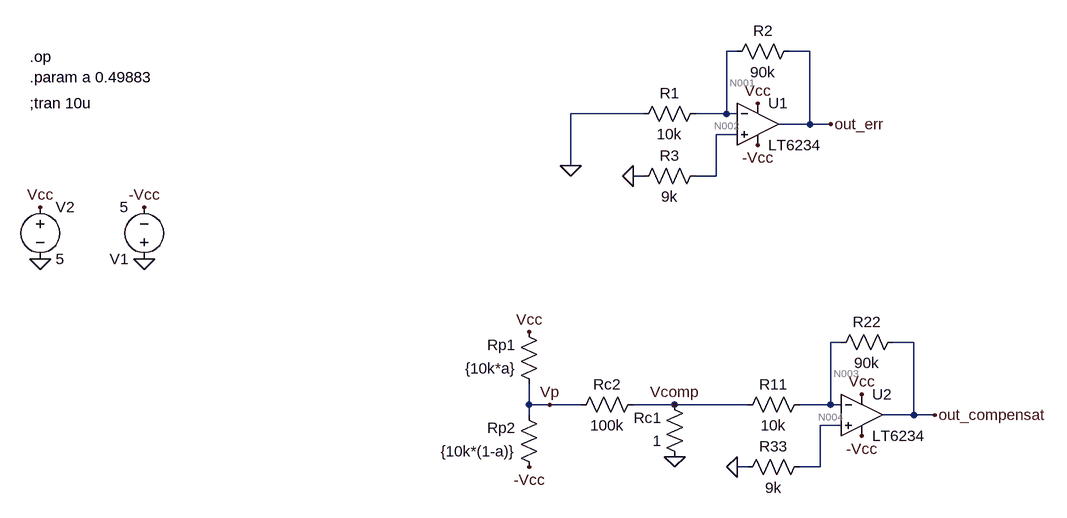
[diagram p0: schematic CompensareDC.asc]
CompensareDC.asc, the LTspice schematic file:
Version 4
SHEET 1 1796 800
WIRE 208 -320 192 -320
WIRE 320 -320 288 -320
WIRE 64 -224 -48 -224
WIRE 192 -224 192 -320
WIRE 192 -224 144 -224
WIRE 208 -224 192 -224
WIRE 320 -208 320 -320
WIRE 320 -208 272 -208
WIRE 352 -208 320 -208
WIRE 208 -192 176 -192
WIRE -48 -144 -48 -224
WIRE 64 -128 48 -128
WIRE 176 -128 176 -192
WIRE 176 -128 144 -128
WIRE 368 128 352 128
WIRE 480 128 448 128
WIRE -112 224 -112 192
WIRE -80 224 -112 224
WIRE -32 224 -80 224
WIRE 112 224 48 224
WIRE 224 224 112 224
WIRE 352 224 352 128
WIRE 352 224 304 224
WIRE 368 224 352 224
WIRE -112 240 -112 224
WIRE 480 240 480 128
WIRE 480 240 432 240
WIRE 512 240 480 240
WIRE 368 256 336 256
WIRE 224 320 208 320
WIRE 336 320 336 256
WIRE 336 320 304 320
FLAG -864 0 0
FLAG -704 0 0
FLAG -864 -80 Vcc
FLAG -704 -80 -Vcc
FLAG 240 -240 Vcc
FLAG 240 -176 -Vcc
FLAG 48 -128 0
FLAG 352 -208 out_err
FLAG 400 208 Vcc
FLAG 400 272 -Vcc
FLAG 208 320 0
FLAG 512 240 out_compensat
FLAG 112 304 0
FLAG -112 112 Vcc
FLAG -112 320 -Vcc
FLAG -48 -144 0
FLAG -80 224 Vp
FLAG 112 224 Vcomp
SYMBOL OpAmps\\LT6234 240 -208 R0
SYMATTR InstName U1
SYMBOL voltage -864 -96 R0
WINDOW 123 0 0 Left 0
WINDOW 39 0 0 Left 0
SYMATTR InstName V2
SYMATTR Value 5
SYMBOL voltage -704 16 R180
WINDOW 123 0 0 Left 0
WINDOW 39 0 0 Left 0
SYMATTR InstName V1
SYMATTR Value 5
SYMBOL res 160 -240 R90
WINDOW 0 0 56 VBottom 2
WINDOW 3 32 56 VTop 2
SYMATTR InstName R1
SYMATTR Value 10k
SYMBOL res 304 -336 R90
WINDOW 0 0 56 VBottom 2
WINDOW 3 32 56 VTop 2
SYMATTR InstName R2
SYMATTR Value 90k
SYMBOL res 160 -144 R90
WINDOW 0 0 56 VBottom 2
WINDOW 3 32 56 VTop 2
SYMATTR InstName R3
SYMATTR Value 9k
SYMBOL OpAmps\\LT6234 400 240 R0
SYMATTR InstName U2
SYMBOL res 320 208 R90
WINDOW 0 0 56 VBottom 2
WINDOW 3 32 56 VTop 2
SYMATTR InstName R11
SYMATTR Value 10k
SYMBOL res 464 112 R90
WINDOW 0 0 56 VBottom 2
WINDOW 3 32 56 VTop 2
SYMATTR InstName R22
SYMATTR Value 90k
SYMBOL res 320 304 R90
WINDOW 0 0 56 VBottom 2
WINDOW 3 32 56 VTop 2
SYMATTR InstName R33
SYMATTR Value 9k
SYMBOL res 128 320 R180
WINDOW 0 36 76 Left 2
WINDOW 3 36 40 Left 2
SYMATTR InstName Rc1
SYMATTR Value 1
SYMBOL res 64 208 R90
WINDOW 0 0 56 VBottom 2
WINDOW 3 32 56 VTop 2
SYMATTR InstName Rc2
SYMATTR Value 100k
SYMBOL res -96 208 R180
WINDOW 0 36 76 Left 2
WINDOW 3 36 40 Left 2
SYMATTR InstName Rp1
SYMATTR Value {10k*a}
SYMBOL res -96 336 R180
WINDOW 0 36 76 Left 2
WINDOW 3 36 40 Left 2
SYMATTR InstName Rp2
SYMATTR Value {10k*(1-a)}
TEXT -880 -312 Left 2 !.op
TEXT -880 -280 Left 2 !.param a 0.49883
TEXT -880 -240 Left 2 !;tran 10u

The netlist it stands for:
* CompensareDC.asc
* U1: LT6234 (symbol OpAmps\LT6234 not available, pins judged from their places): In+=N002 In-=N001 V+=Vcc V-=-Vcc OUT=out_err
V2 Vcc 0 5
V1 0 -Vcc 5
R1 N001 0 10k
R2 out_err N001 90k
R3 N002 0 9k
* U2: LT6234 (symbol OpAmps\LT6234 not available, pins judged from their places): In+=N004 In-=N003 V+=Vcc V-=-Vcc OUT=out_compensat
R11 N003 Vcomp 10k
R22 out_compensat N003 90k
R33 N004 0 9k
Rc1 0 Vcomp 1
Rc2 Vcomp Vp 100k
Rp1 Vp Vcc {10k*a}
Rp2 -Vcc Vp {10k*(1-a)}
.op
.param a 0.49883
;tran 10u
.backanno
.end

* Results of the author's LTspice run, read from the files saved beside the schematic
* Operating Point:
*   V(out_err) = -11.12 µV
*   V(-vcc) = -5 V
*   V(vcc) = 5 V
*   V(n002) = -13.49 mV
*   V(n001) = -13.5 mV
*   V(out_compensat) = -5.337 nV
*   V(n004) = -13.49 mV
*   V(n003) = -13.5 mV
*   V(vcomp) = -1.235 µV
*   V(vp) = 11.41 mV
*   I(R1) = -1.35 µA
*   I(R2) = 149.8 nA
*   I(R3) = -1.499 µA
*   I(R11) = -1.349 µA
*   I(R22) = 149.9 nA
*   I(R33) = -1.499 µA
*   I(Rc1) = 1.235 µA
*   I(Rc2) = -114.2 nA
*   I(Rp1) = -1 mA
*   I(Rp2) = -999.9 µA
*   I(V2) = -3.081 mA
*   I(V1) = -3.086 mA
*   Ix(u1:1) = 1.499 µA
*   Ix(u1:2) = 1.499 µA
*   Ix(u1:3) = -149.8 nA
*   Ix(u1:4) = 1.04 mA
*   Ix(u1:5) = -1.043 mA
*   Ix(u2:1) = 1.499 µA
*   Ix(u2:2) = 1.499 µA
*   Ix(u2:3) = -149.9 nA
*   Ix(u2:4) = 1.04 mA
*   Ix(u2:5) = -1.043 mA
* From the log:
*   Semiconductor Device Operating Points:
*                           --- Diodes ---
*   Name:    d:u1:5      d:u1:8      d:u1:1      d:u1:2      d:u1:4
*   Model:  u1:dlimn1   u1:dlimp1    u1:din     u1:dlimp2   u1:dlimn2
*   Id:      3.72e-09    3.72e-09   -6.40e-13    4.34e-10    4.34e-10
*   Vd:      3.72e-01    3.72e-01   -6.40e-07    3.72e-01    3.72e-01
*   Req:     1.00e-08    1.00e-08    1.00e-06    3.33e-08    3.33e-08
*   CAP:     0.00e+00    0.00e+00    0.00e+00    0.00e+00    0.00e+00
*   Name:    d:u1:7      d:u1:3      d:u1:6      d:u2:5      d:u2:8
*   Model:  u1:dlim2    u1:dbias    u1:dbias    u2:dlimn1   u2:dlimp1
*   Id:      2.97e-09    1.50e-06    1.50e-06    3.72e-09    3.72e-09
*   Vd:      2.08e-01    4.99e+00    4.99e+00    3.72e-01    3.72e-01
*   Req:     1.43e-08    2.00e-04    2.00e-04    1.00e-08    1.00e-08
*   CAP:     0.00e+00    0.00e+00    0.00e+00    0.00e+00    0.00e+00
*   Name:    d:u2:1      d:u2:2      d:u2:4      d:u2:7      d:u2:3
*   Model:   u2:din     u2:dlimp2   u2:dlimn2   u2:dlim2    u2:dbias
*   Id:     -6.40e-13    4.34e-10    4.34e-10    2.97e-09    1.50e-06
*   Vd:     -6.40e-07    3.72e-01    3.72e-01    2.08e-01    4.99e+00
*   Req:     1.00e-06    3.33e-08    3.33e-08    1.43e-08    2.00e-04
*   CAP:     0.00e+00    0.00e+00    0.00e+00    0.00e+00    0.00e+00
*   Name:    d:u2:6
*   Model:  u2:dbias
*   Id:      1.50e-06
*   Vd:      4.99e+00
*   Req:     2.00e-04
*   CAP:     0.00e+00
*                           --- VDMOSFET Transistors ---
*   Name:        m:u1:1      m:u1:2      m:u2:1      m:u2:2
*   Model:        u1:ni       u1:pi       u2:ni       u2:pi
*   Id:          1.04e-03   -1.04e-03    1.04e-03   -1.04e-03
*   Vgs:         3.72e-01   -3.72e-01    3.72e-01   -3.72e-01
*   Vds:         5.00e+00   -5.00e+00    5.00e+00   -5.00e+00
*   Vth:         3.00e-01   -3.00e-01    3.00e-01   -3.00e-01
*   Gm:          2.88e-02    2.88e-02    2.88e-02    2.88e-02
*   Gds:         0.00e+00    0.00e+00    0.00e+00    0.00e+00
*   Cgs:         0.00e+00    0.00e+00    0.00e+00    0.00e+00
*   Cgd:         0.00e+00    0.00e+00    0.00e+00    0.00e+00
*   Cbody:       0.00e+00    0.00e+00    0.00e+00    0.00e+00